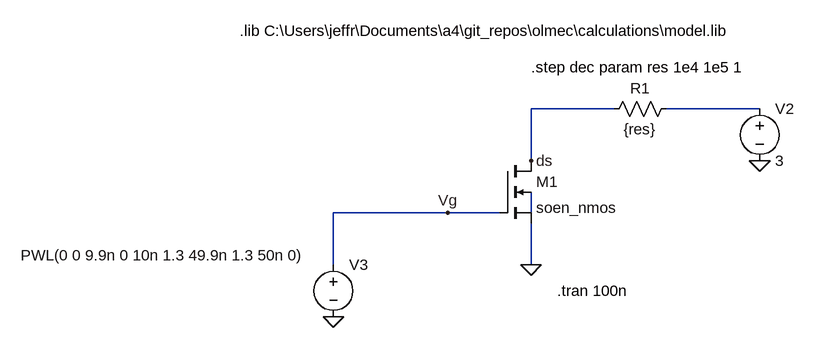
[diagram p0: schematic mosfet_r_follower.asc]
mosfet_r_follower.asc, the LTspice schematic file:
Version 4
SHEET 1 880 680
WIRE -144 144 -272 144
WIRE 80 144 -64 144
WIRE -272 224 -272 144
WIRE -400 304 -576 304
WIRE -320 304 -400 304
WIRE -272 304 -272 272
WIRE -576 384 -576 304
WIRE -272 384 -272 320
FLAG 80 224 0
FLAG -576 464 0
FLAG -272 224 ds
FLAG -400 304 Vg
FLAG -272 384 0
SYMBOL voltage 80 128 R0
WINDOW 123 0 0 Left 0
WINDOW 39 0 0 Left 0
SYMATTR InstName V2
SYMATTR Value 3
SYMBOL voltage -576 368 R0
WINDOW 123 0 0 Left 0
WINDOW 39 0 0 Left 0
WINDOW 3 -481 1 Left 2
SYMATTR InstName V3
SYMATTR Value PWL(0 0 9.9n 0 10n 1.3 49.9n 1.3 50n 0)
SYMBOL nmos4 -320 224 R0
SYMATTR InstName M1
SYMATTR Value soen_nmos
SYMATTR Value2 l=1u w=10u
SYMBOL res -48 128 R90
WINDOW 0 0 56 VBottom 2
WINDOW 3 32 56 VTop 2
SYMATTR InstName R1
SYMATTR Value {res}
TEXT -232 424 Left 2 !.tran 100n
TEXT -720 24 Left 2 !.lib C:\\Users\\jeffr\\Documents\\a4\\git_repos\\olmec\\calculations\\model.lib
TEXT -272 80 Left 2 !.step dec param res 1e4 1e5 1

The netlist it stands for:
* mosfet_r_follower.asc
V2 N001 0 3
V3 Vg 0 PWL(0 0 9.9n 0 10n 1.3 49.9n 1.3 50n 0)
M1 ds Vg 0 N002 soen_nmos l=1u w=10u
R1 N001 ds {res}
.model NMOS NMOS
.model PMOS PMOS
.lib standard.mos
.tran 100n
.lib C:\Users\jeffr\Documents\a4\git_repos\olmec\calculations\model.lib
.step dec param res 1e4 1e5 1
.backanno
.end